# Altium project Hub_Unit - Copy.PrjPcb (part 2 of 2)
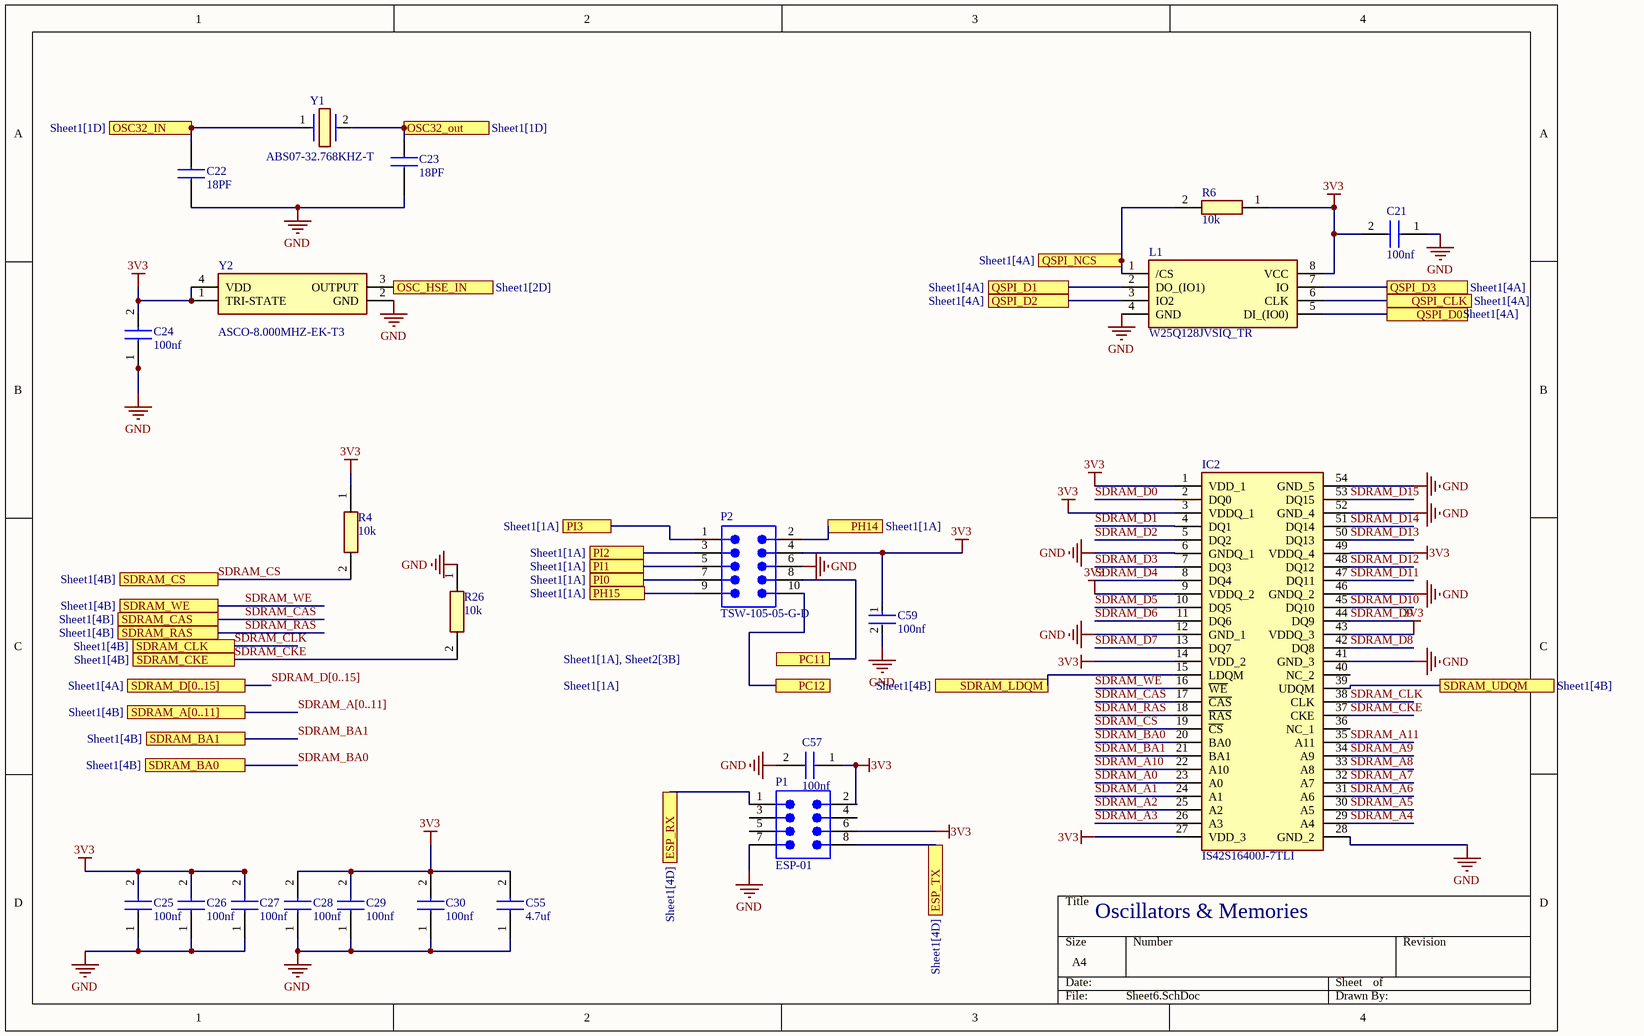
[diagram p6: Sheet6.SchDoc]

## Nets that join several sheets
3V3: Sheet1 (19 pins), Sheet2 (12 pins), Sheet3 (19 pins), Sheet4 (19 pins), Sheet5 (7 pins), Sheet6 (26 pins)
+5: Sheet2 (9 pins), Sheet4 (6 pins), Sheet5 (C32.1 C54.2 IC6.1 L2.1)
GND: Sheet1 (16 pins), Sheet2 (27 pins), Sheet3 (24 pins), Sheet4 (20 pins), Sheet5 (22 pins), Sheet6 (24 pins)
VDDA: Sheet1 (IC1.42), Sheet3 (C5.1 C8.2 Ferrite_Chip_Bead.2 R5.2)
VREF+: Sheet1 (IC1.41), Sheet3 (C1.2 C2.2 R5.1)
ESP_RX: Sheet1 (IC1.143), Sheet6 (P1.1)
ESP_TX: Sheet1 (IC1.144), Sheet6 (P1.8)
LCD_B0: Sheet1 (IC1.3), Sheet5 (J2.21)
LCD_B1: Sheet1 (IC1.181), Sheet5 (J2.22)
LCD_B2: Sheet1 (IC1.172), Sheet5 (J2.23)
LCD_B3: Sheet1 (IC1.180), Sheet5 (J2.24)
LCD_B4: Sheet1 (IC1.205), Sheet5 (J2.25)
LCD_B5: Sheet1 (IC1.50), Sheet5 (J2.26)
LCD_B6: Sheet1 (IC1.188), Sheet5 (J2.27)
LCD_B7: Sheet1 (IC1.189), Sheet5 (J2.28)
LCD_BL_CTRL: Sheet1 (IC1.140), Sheet5 (P3.2)
LCD_DCLK: Sheet1 (IC1.21), Sheet5 (J2.30)
LCD_DE: Sheet1 (IC1.190), Sheet5 (J2.34)
LCD_DISP: Sheet1 (IC1.183), Sheet5 (J2.31 R7.2)
LCD_G0: Sheet1 (IC1.4), Sheet5 (J2.13)
LCD_G1: Sheet1 (IC1.5), Sheet5 (J2.14)
LCD_G2: Sheet1 (IC1.55), Sheet5 (J2.15)
LCD_G3: Sheet1 (IC1.179), Sheet5 (J2.16)
LCD_G4: Sheet1 (IC1.90), Sheet5 (J2.17)
LCD_G5: Sheet1 (IC1.91), Sheet5 (J2.18)
LCD_G6: Sheet1 (IC1.139), Sheet5 (J2.19)
LCD_G7: Sheet1 (IC1.167), Sheet5 (J2.20)
LCD_HSYNC: Sheet1 (IC1.12), Sheet5 (J2.32)
LCD_INT: Sheet1 (IC1.58), Sheet5 (J2.38 J15.2)
LCD_R0: Sheet1 (IC1.182), Sheet5 (J2.5)
LCD_R1: Sheet1 (IC1.65), Sheet5 (J2.6)
LCD_R2: Sheet1 (IC1.66), Sheet5 (J2.7)
LCD_R3: Sheet1 (IC1.61), Sheet5 (J2.8)
LCD_R4: Sheet1 (IC1.145), Sheet5 (J2.9)
LCD_R5: Sheet1 (IC1.35), Sheet5 (J2.10)
LCD_R6: Sheet1 (IC1.62), Sheet5 (J2.11)
LCD_R7: Sheet1 (IC1.133), Sheet5 (J2.12)
LCD_RST: Sheet1 (IC1.57), Sheet5 (J2.37 J15.4)
LCD_SCL: Sheet1 (IC1.198), Sheet5 (J2.39 J15.8 R18.1)
LCD_SDA: Sheet1 (IC1.199), Sheet5 (J2.40 J15.6 R17.1)
LCD_VSYNC: Sheet1 (IC1.11), Sheet5 (J2.33)
NetC6_1: Sheet1 (IC1.148), Sheet3 (C6.1)
NetC7_1: Sheet1 (IC1.92), Sheet3 (C7.1)
NetC22_2: Sheet1 (IC1.9), Sheet6 (C22.2 Y1.1)
NetC23_2: Sheet1 (IC1.10), Sheet6 (C23.2 Y1.2)
NetC41_2: Sheet1 (IC1.44), Sheet4 (5 pins)
NetIC1_32: Sheet1 (IC1.32), Sheet6 (Y2.3)
NetIC1_34: Sheet1 (IC1.34 R3.1), Sheet2 (J3.12)
NetIC1_46: Sheet1 (IC1.46), Sheet4 (IC8.1 R13.2 R15.1 R25.1)
NetIC1_97: Sheet1 (IC1.97), Sheet4 (IC4.4 R12.2)
NetIC1_98: Sheet1 (IC1.98), Sheet4 (IC4.3 R10.1)
NetIC1_101: Sheet1 (IC1.101), Sheet4 (IC3.9 R11.2)
NetIC1_102: Sheet1 (IC1.102), Sheet4 (IC3.10 R9.1)
NetIC1_127: Sheet1 (IC1.127), Sheet4 (R20.1)
NetIC1_151: Sheet1 (IC1.151 IC1.153), Sheet6 (P2.9)
NetIC1_152: Sheet1 (IC1.152), Sheet6 (P2.2)
NetIC1_154: Sheet1 (IC1.154), Sheet6 (P2.7)
NetIC1_155: Sheet1 (IC1.155), Sheet6 (P2.5)
NetIC1_156: Sheet1 (IC1.156), Sheet6 (P2.3)
NetIC1_157: Sheet1 (IC1.157), Sheet6 (P2.1)
NetIC1_161: Sheet1 (IC1.161), Sheet2 (U1.5)
NetIC1_162: Sheet1 (IC1.162), Sheet2 (U1.6), Sheet6 (P2.8)
NetIC1_163: Sheet1 (IC1.163), Sheet6 (P2.10)
QSPI_CLK: Sheet1 (IC1.63), Sheet6 (L1.6)
QSPI_D0: Sheet1 (IC1.29), Sheet6 (L1.5)
QSPI_D1: Sheet1 (IC1.30), Sheet6 (L1.2)
QSPI_D2: Sheet1 (IC1.28), Sheet6 (L1.3)
QSPI_D3: Sheet1 (IC1.27), Sheet6 (L1.7)
QSPI_NCS: Sheet1 (IC1.195), Sheet6 (L1.1 R6.2)
SDRAM_A0: Sheet1 (IC1.16), Sheet6 (IC2.23)
SDRAM_A1: Sheet1 (IC1.17), Sheet6 (IC2.24)
SDRAM_A2: Sheet1 (IC1.18), Sheet6 (IC2.25)
SDRAM_A3: Sheet1 (IC1.22), Sheet6 (IC2.26)
SDRAM_A4: Sheet1 (IC1.23), Sheet6 (IC2.29)
SDRAM_A5: Sheet1 (IC1.24), Sheet6 (IC2.30)
SDRAM_A6: Sheet1 (IC1.71), Sheet6 (IC2.31)
SDRAM_A7: Sheet1 (IC1.74), Sheet6 (IC2.32)
SDRAM_A8: Sheet1 (IC1.75), Sheet6 (IC2.33)
SDRAM_A9: Sheet1 (IC1.76), Sheet6 (IC2.34)
SDRAM_A10: Sheet1 (IC1.77), Sheet6 (IC2.22)
SDRAM_A11: Sheet1 (IC1.78), Sheet6 (IC2.35)
SDRAM_BA0: Sheet1 (IC1.131), Sheet6 (IC2.20)
SDRAM_BA1: Sheet1 (IC1.132), Sheet6 (IC2.21)
SDRAM_CAS: Sheet1 (IC1.191), Sheet6 (IC2.17)
SDRAM_CKE: Sheet1 (IC1.38), Sheet6 (IC2.37 R26.2)
SDRAM_CLK: Sheet1 (IC1.135), Sheet6 (IC2.38)
SDRAM_CS: Sheet1 (IC1.37), Sheet6 (IC2.19 R4.2)
SDRAM_D0: Sheet1 (IC1.116), Sheet6 (IC2.2)
SDRAM_D1: Sheet1 (IC1.117), Sheet6 (IC2.4)
SDRAM_D2: Sheet1 (IC1.164), Sheet6 (IC2.5)
SDRAM_D3: Sheet1 (IC1.165), Sheet6 (IC2.7)
SDRAM_D4: Sheet1 (IC1.79), Sheet6 (IC2.8)
SDRAM_D5: Sheet1 (IC1.80), Sheet6 (IC2.10)
SDRAM_D6: Sheet1 (IC1.81), Sheet6 (IC2.11)
SDRAM_D7: Sheet1 (IC1.84), Sheet6 (IC2.13)
SDRAM_D8: Sheet1 (IC1.85), Sheet6 (IC2.42)
SDRAM_D9: Sheet1 (IC1.86), Sheet6 (IC2.44)
SDRAM_D10: Sheet1 (IC1.87), Sheet6 (IC2.45)
SDRAM_D11: Sheet1 (IC1.88), Sheet6 (IC2.47)
SDRAM_D12: Sheet1 (IC1.89), Sheet6 (IC2.48)
SDRAM_D13: Sheet1 (IC1.108), Sheet6 (IC2.50)
SDRAM_D14: Sheet1 (IC1.109), Sheet6 (IC2.51)
SDRAM_D15: Sheet1 (IC1.110), Sheet6 (IC2.53)
SDRAM_LDQM: Sheet1 (IC1.200), Sheet6 (IC2.15)
SDRAM_RAS: Sheet1 (IC1.70), Sheet6 (IC2.18)
SDRAM_UDQM: Sheet1 (IC1.201), Sheet6 (IC2.39)
SDRAM_WE: Sheet1 (IC1.49), Sheet6 (IC2.16)
SWCLK: Sheet1 (IC1.159), Sheet2 (J3.6)
SWDIO: Sheet1 (IC1.147), Sheet2 (J3.4)
SWO: Sheet1 (IC1.192), Sheet2 (J3.8)